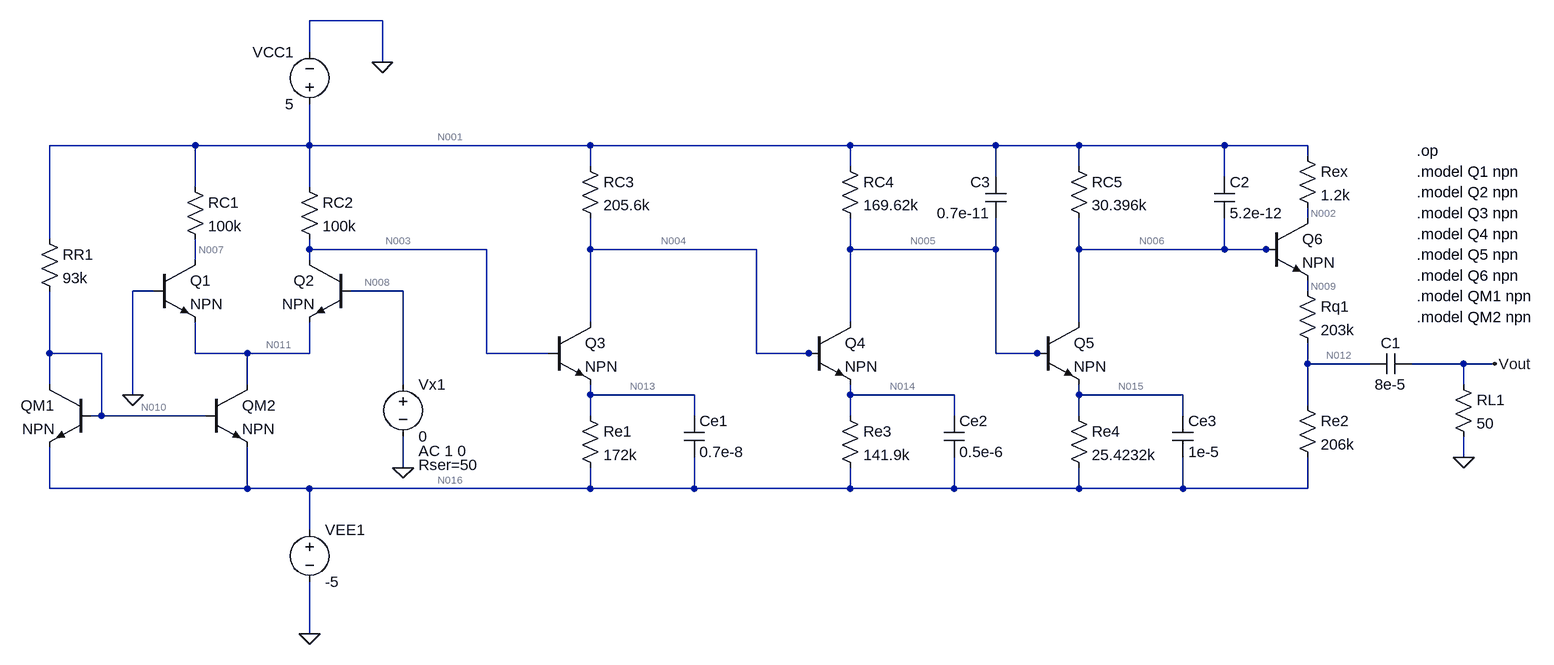
[diagram p0: schematic Small Signal Parameters.asc]
Small Signal Parameters.asc, the LTspice schematic file:
Version 4
SHEET 1 1920 1200
WIRE 64 -160 -48 -160
WIRE -48 -112 -48 -160
WIRE 64 -96 64 -160
WIRE -224 32 -448 32
WIRE -48 32 -48 -32
WIRE -48 32 -224 32
WIRE 384 32 -48 32
WIRE 784 32 384 32
WIRE 1008 32 784 32
WIRE 1136 32 1008 32
WIRE 1360 32 1136 32
WIRE 1488 32 1360 32
WIRE 1488 48 1488 32
WIRE 384 64 384 32
WIRE 784 64 784 32
WIRE 1136 64 1136 32
WIRE 1008 80 1008 32
WIRE 1360 80 1360 32
WIRE -224 96 -224 32
WIRE -48 96 -48 32
WIRE 1488 144 1488 128
WIRE -448 176 -448 32
WIRE -48 192 -48 176
WIRE 224 192 -48 192
WIRE 384 192 384 144
WIRE 640 192 384 192
WIRE 784 192 784 144
WIRE 1008 192 1008 144
WIRE 1008 192 784 192
WIRE 1136 192 1136 144
WIRE 1360 192 1360 144
WIRE 1360 192 1136 192
WIRE 1424 192 1360 192
WIRE 1440 192 1424 192
WIRE -224 208 -224 176
WIRE -48 208 -48 192
WIRE -288 256 -320 256
WIRE 96 256 16 256
WIRE 1488 256 1488 240
WIRE 384 304 384 192
WIRE 784 304 784 192
WIRE 1136 304 1136 192
WIRE -448 352 -448 256
WIRE -368 352 -448 352
WIRE -224 352 -224 304
WIRE -144 352 -224 352
WIRE -48 352 -48 304
WIRE -48 352 -144 352
WIRE 224 352 224 192
WIRE 320 352 224 352
WIRE 640 352 640 192
WIRE 720 352 640 352
WIRE 736 352 720 352
WIRE 1008 352 1008 192
WIRE 1072 352 1008 352
WIRE 1088 352 1072 352
WIRE 1488 368 1488 336
WIRE 1584 368 1488 368
WIRE 1728 368 1648 368
WIRE 1776 368 1728 368
WIRE -448 400 -448 352
WIRE -144 400 -144 352
WIRE 96 400 96 256
WIRE 1728 400 1728 368
WIRE -320 416 -320 256
WIRE 384 416 384 400
WIRE 544 416 384 416
WIRE 784 416 784 400
WIRE 944 416 784 416
WIRE 1136 416 1136 400
WIRE 1296 416 1136 416
WIRE 1488 432 1488 368
WIRE -368 448 -368 352
WIRE -368 448 -384 448
WIRE -208 448 -368 448
WIRE 384 448 384 416
WIRE 544 448 544 416
WIRE 784 448 784 416
WIRE 944 448 944 416
WIRE 1136 448 1136 416
WIRE 1296 448 1296 416
WIRE 1728 512 1728 480
WIRE 96 528 96 480
WIRE -448 560 -448 496
WIRE -144 560 -144 496
WIRE -144 560 -448 560
WIRE -48 560 -144 560
WIRE 384 560 384 528
WIRE 384 560 -48 560
WIRE 544 560 544 512
WIRE 544 560 384 560
WIRE 784 560 784 528
WIRE 784 560 544 560
WIRE 944 560 944 512
WIRE 944 560 784 560
WIRE 1136 560 1136 528
WIRE 1136 560 944 560
WIRE 1296 560 1296 512
WIRE 1296 560 1136 560
WIRE 1488 560 1488 512
WIRE 1488 560 1296 560
WIRE -48 624 -48 560
WIRE -48 784 -48 704
FLAG -48 784 0
FLAG 64 -96 0
FLAG 96 528 0
FLAG 1728 512 0
FLAG 1776 368 Vout
FLAG -320 416 0
SYMBOL res -240 80 R0
SYMATTR InstName RC1
SYMATTR Value 100k
SYMBOL res -64 80 R0
SYMATTR InstName RC2
SYMATTR Value 100k
SYMBOL Res 368 432 R0
SYMATTR InstName Re1
SYMATTR Value 172k
SYMBOL Res -464 160 R0
SYMATTR InstName RR1
SYMATTR Value 93k
SYMBOL Res 368 48 R0
SYMATTR InstName RC3
SYMATTR Value 205.6k
SYMBOL npn -288 208 R0
SYMATTR InstName Q1
SYMBOL npn 320 304 R0
SYMATTR InstName Q3
SYMBOL npn -208 400 R0
SYMATTR InstName QM2
SYMBOL npn -384 400 M0
SYMATTR InstName QM1
SYMBOL npn 16 208 M0
SYMATTR InstName Q2
SYMBOL voltage -48 608 R0
SYMATTR InstName VEE1
SYMATTR Value -5
SYMBOL voltage -48 -16 R180
WINDOW 0 24 96 Left 2
WINDOW 3 24 16 Left 2
SYMATTR InstName VCC1
SYMATTR Value 5
SYMBOL voltage 96 384 R0
WINDOW 123 24 118 Left 2
WINDOW 39 24 140 Left 2
SYMATTR Value2 AC 1 0
SYMATTR SpiceLine Rser=50
SYMATTR InstName Vx1
SYMATTR Value 0
SYMBOL cap 528 448 R0
SYMATTR InstName Ce1
SYMATTR Value 0.7e-8
SYMBOL Res 1472 416 R0
SYMATTR InstName Re2
SYMATTR Value 206k
SYMBOL Res 1712 384 R0
SYMATTR InstName RL1
SYMATTR Value 50
SYMBOL cap 1648 352 R90
WINDOW 0 0 32 VBottom 2
WINDOW 3 32 32 VTop 2
SYMATTR InstName C1
SYMATTR Value 8e-5
SYMBOL Res 768 432 R0
SYMATTR InstName Re3
SYMATTR Value 141.9k
SYMBOL Res 768 48 R0
SYMATTR InstName RC4
SYMATTR Value 169.62k
SYMBOL npn 720 304 R0
SYMATTR InstName Q4
SYMBOL cap 928 448 R0
SYMATTR InstName Ce2
SYMATTR Value 0.5e-6
SYMBOL Res 1472 240 R0
SYMATTR InstName Rq1
SYMATTR Value 203k
SYMBOL Res 1120 432 R0
SYMATTR InstName Re4
SYMATTR Value 25.4232k
SYMBOL Res 1120 48 R0
SYMATTR InstName RC5
SYMATTR Value 30.396k
SYMBOL npn 1072 304 R0
SYMATTR InstName Q5
SYMBOL cap 1280 448 R0
SYMATTR InstName Ce3
SYMATTR Value 1e-5
SYMBOL cap 1344 80 R0
SYMATTR InstName C2
SYMATTR Value 5.2e-12
SYMBOL cap 1024 144 R180
WINDOW 0 24 56 Left 2
WINDOW 3 24 8 Left 2
SYMATTR InstName C3
SYMATTR Value 0.7e-11
SYMBOL npn 1424 144 R0
SYMATTR InstName Q6
SYMBOL Res 1472 32 R0
SYMATTR InstName Rex
SYMATTR Value 1.2k
TEXT 1656 40 Left 2 !.op
TEXT 1656 72 Left 2 !.model Q1 npn
TEXT 1656 104 Left 2 !.model Q2 npn
TEXT 1656 136 Left 2 !.model Q3 npn
TEXT 1656 168 Left 2 !.model Q4 npn
TEXT 1656 200 Left 2 !.model Q5 npn
TEXT 1656 232 Left 2 !.model Q6 npn
TEXT 1656 264 Left 2 !.model QM1 npn
TEXT 1656 296 Left 2 !.model QM2 npn

The netlist it stands for:
* Small Signal Parameters.asc
RC1 N001 N007 100k
RC2 N001 N003 100k
Re1 N013 N016 172k
RR1 N001 N010 93k
RC3 N001 N004 205.6k
Q1 N007 0 N011 0 NPN
Q3 N004 N003 N013 0 NPN
QM2 N011 N010 N016 0 NPN
QM1 N010 N010 N016 0 NPN
Q2 N003 N008 N011 0 NPN
VEE1 N016 0 -5
VCC1 N001 0 5
Vx1 N008 0 0 AC 1 0 Rser=50
Ce1 N013 N016 0.7e-8
Re2 N012 N016 206k
RL1 Vout 0 50
C1 Vout N012 8e-5
Re3 N014 N016 141.9k
RC4 N001 N005 169.62k
Q4 N005 N004 N014 0 NPN
Ce2 N014 N016 0.5e-6
Rq1 N009 N012 203k
Re4 N015 N016 25.4232k
RC5 N001 N006 30.396k
Q5 N006 N005 N015 0 NPN
Ce3 N015 N016 1e-5
C2 N001 N006 5.2e-12
C3 N005 N001 0.7e-11
Q6 N002 N006 N009 0 NPN
Rex N001 N002 1.2k
.model NPN NPN
.model PNP PNP
.lib standard.bjt
.op
.model Q1 npn
.model Q2 npn
.model Q3 npn
.model Q4 npn
.model Q5 npn
.model Q6 npn
.model QM1 npn
.model QM2 npn
.backanno
.end

* Results of the author's LTspice run, read from the files saved beside the schematic
* Operating Point:
*   V(n001) = 5 V
*   V(n007) = 151.7 mV
*   V(n003) = 130.2 mV
*   V(n013) = -549.3 mV
*   V(n016) = -5 V
*   V(n010) = -4.286 V
*   V(n004) = -323.9 mV
*   V(n011) = -696 mV
*   V(n008) = -24.22 µV
*   V(n012) = -2.837 V
*   V(vout) = -11.35 fV
*   V(n014) = -1.006 V
*   V(n005) = -9.114 mV
*   V(n009) = -705.8 mV
*   V(n015) = -736.9 mV
*   V(n006) = -49.66 mV
*   V(n002) = 4.988 V
*   Ic(Q6) = 10.4 µA
*   Ib(Q6) = 103.9 nA
*   Ie(Q6) = -10.5 µA
*   Ic(Q5) = 166 µA
*   Ib(Q5) = 1.66 µA
*   Ie(Q5) = -167.7 µA
*   Ic(Q4) = 27.87 µA
*   Ib(Q4) = 278.7 nA
*   Ie(Q4) = -28.15 µA
*   Ic(Q2) = 48.44 µA
*   Ib(Q2) = 484.4 nA
*   Ie(Q2) = -48.92 µA
*   Ic(Qm1) = 97.89 µA
*   Ib(Qm1) = 978.9 nA
*   Ie(Qm1) = -98.87 µA
*   Ic(Qm2) = 97.89 µA
*   Ib(Qm2) = 978.9 nA
*   Ie(Qm2) = -98.87 µA
*   Ic(Q3) = 25.62 µA
*   Ib(Q3) = 260.5 nA
*   Ie(Q3) = -25.88 µA
*   Ic(Q1) = 48.48 µA
*   Ib(Q1) = 484.8 nA
*   Ie(Q1) = -48.97 µA
*   I(C3) = 0 A
*   I(C2) = 0 A
*   I(Ce3) = 0 A
*   I(Ce2) = 0 A
*   I(C1) = 0 A
*   I(Ce1) = 0 A
*   I(Rex) = 10.4 µA
*   I(Rc5) = 166.1 µA
*   I(Re4) = 167.7 µA
*   I(Rq1) = 10.5 µA
*   I(Rc4) = 29.53 µA
*   I(Re3) = 28.15 µA
*   I(Rl1) = 0 A
*   I(Re2) = 10.5 µA
*   I(Rc3) = 25.89 µA
*   I(Rr1) = 99.85 µA
*   I(Re1) = 25.88 µA
*   I(Rc2) = 48.7 µA
*   I(Rc1) = 48.48 µA
*   I(Vx1) = -484.4 nA
*   I(Vcc1) = -429 µA
*   I(Vee1) = 429.9 µA
* From the log:
*   Semiconductor Device Operating Points:
*                           --- Bipolar Transistors ---
*   Name:       q6          q5          q4          q2          qm1
*   Model:      npn         npn         npn         npn         npn
*   Ib:       1.04e-07    1.66e-06    2.79e-07    4.84e-07    9.79e-07
*   Ic:       1.04e-05    1.66e-04    2.79e-05    4.84e-05    9.79e-05
*   Vbe:      6.56e-01    7.28e-01    6.82e-01    6.96e-01    7.14e-01
*   Vbc:     -5.04e+00    4.05e-02   -3.15e-01   -1.30e-01    0.00e+00
*   Vce:      5.69e+00    6.87e-01    9.96e-01    8.26e-01    7.14e-01
*   BetaDC:   1.00e+02    1.00e+02    1.00e+02    1.00e+02    1.00e+02
*   Gm:       4.02e-04    6.42e-03    1.08e-03    1.87e-03    3.78e-03
*   Rpi:      2.49e+05    1.56e+04    9.28e+04    5.34e+04    2.64e+04
*   Rx:       0.00e+00    0.00e+00    0.00e+00    0.00e+00    0.00e+00
*   Ro:       9.80e+98    5.39e+13    4.99e+19    3.97e+16    2.59e+14
*   Cbe:      0.00e+00    0.00e+00    0.00e+00    0.00e+00    0.00e+00
*   Cbc:      0.00e+00    0.00e+00    0.00e+00    0.00e+00    0.00e+00
*   Cjs:      0.00e+00    0.00e+00    0.00e+00    0.00e+00    0.00e+00
*   BetaAC:   1.00e+02    1.00e+02    1.00e+02    1.00e+02    1.00e+02
*   Cbx:      0.00e+00    0.00e+00    0.00e+00    0.00e+00    0.00e+00
*   Ft:       0.00e+00    0.00e+00    0.00e+00    0.00e+00    0.00e+00
*   Name:       qm2         q3          q1
*   Model:      npn         npn         npn
*   Ib:       9.79e-07    2.60e-07    4.85e-07
*   Ic:       9.79e-05    2.56e-05    4.85e-05
*   Vbe:      7.14e-01    6.79e-01    6.96e-01
*   Vbc:     -3.59e+00    4.54e-01   -1.52e-01
*   Vce:      4.30e+00    2.25e-01    8.48e-01
*   BetaDC:   1.00e+02    9.84e+01    1.00e+02
*   Gm:       3.78e-03    9.91e-04    1.87e-03
*   Rpi:      2.64e+04    1.01e+05    5.33e+04
*   Rx:       0.00e+00    0.00e+00    0.00e+00
*   Ro:       4.90e+74    6.14e+06    9.11e+16
*   Cbe:      0.00e+00    0.00e+00    0.00e+00
*   Cbc:      0.00e+00    0.00e+00    0.00e+00
*   Cjs:      0.00e+00    0.00e+00    0.00e+00
*   BetaAC:   1.00e+02    1.00e+02    1.00e+02
*   Cbx:      0.00e+00    0.00e+00    0.00e+00
*   Ft:       0.00e+00    0.00e+00    0.00e+00
*   Operating Bias Point Solution:
*   V(n001)                  5   voltage
*   V(n007)           0.151675   voltage
*   V(n003)           0.130167   voltage
*   V(n013)          -0.549289   voltage
*   V(n016)                 -5   voltage
*   V(n010)           -4.28588   voltage
*   V(n004)          -0.323906   voltage
*   V(n011)           -0.69595   voltage
*   V(n008)        -2.4219e-05   voltage
*   V(n012)           -2.83714   voltage
*   V(vout)       -1.13486e-14   voltage
*   V(n014)           -1.00554   voltage
*   V(n005)        -0.00911383   voltage
*   V(n009)           -0.70578   voltage
*   V(n015)          -0.736902   voltage
*   V(n006)         -0.0496588   voltage
*   V(n002)            4.98753   voltage
*   Ic(Q6)        1.03954e-05   device_current
*   Ib(Q6)        1.03949e-07   device_current
*   Ie(Q6)       -1.04993e-05   device_current
*   Ic(Q5)        0.000166025   device_current
*   Ib(Q5)        1.66025e-06   device_current
*   Ie(Q5)       -0.000167685   device_current
*   Ic(Q4)        2.78711e-05   device_current
*   Ib(Q4)        2.78712e-07   device_current
*   Ie(Q4)       -2.81498e-05   device_current
*   Ic(Q2)        4.84379e-05   device_current
*   Ib(Q2)        4.84379e-07   device_current
*   Ie(Q2)       -4.89223e-05   device_current
*   Ic(Qm1)        9.78903e-05   device_current
*   Ib(Qm1)        9.78904e-07   device_current
*   Ie(Qm1)       -9.88692e-05   device_current
*   Ic(Qm2)        9.78903e-05   device_current
*   Ib(Qm2)          9.789e-07   device_current
*   Ie(Qm2)       -9.88692e-05   device_current
*   Ic(Q3)        2.56158e-05   device_current
*   Ib(Q3)        2.60453e-07   device_current
*   Ie(Q3)       -2.58762e-05   device_current
*   Ic(Q1)        4.84832e-05   device_current
*   Ib(Q1)        4.84833e-07   device_current
*   Ie(Q1)       -4.89681e-05   device_current
*   I(C3)       -3.50638e-23   device_current
*   I(C2)        2.62582e-23   device_current
*   I(Ce3)         4.2631e-17   device_current
*   I(Ce2)        1.99723e-18   device_current
*   I(C1)        2.26971e-16   device_current
*   I(Ce1)         3.1155e-20   device_current
*   I(Rex)        1.03954e-05   device_current
*   I(Rc5)        0.000166129   device_current
*   I(Re4)        0.000167685   device_current
*   I(Rq1)        1.04993e-05   device_current
*   I(Rc4)        2.95314e-05   device_current
*   I(Re3)        2.81498e-05   device_current
*   I(Rl1)       -2.26971e-16   device_current
*   I(Re2)        1.04993e-05   device_current
*   I(Rc3)        2.58945e-05   device_current
*   I(Rr1)        9.98481e-05   device_current
*   I(Re1)        2.58762e-05   device_current
*   I(Rc2)        4.86983e-05   device_current
*   I(Rc1)        4.84832e-05   device_current
*   I(Vx1)       -4.84379e-07   device_current
*   I(Vcc1)        -0.00042898   device_current
*   I(Vee1)        0.000429949   device_current